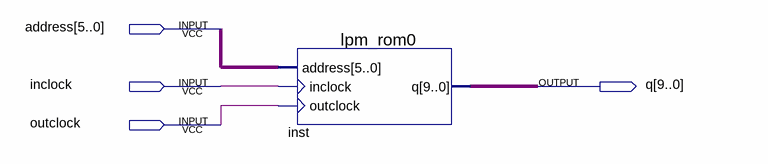
[diagram p0: schematic sheet]
// Quartus schematic lab10_1.bdf as structural Verilog: 1 symbols, 4 pins
module lab10_1 (
  input  [5:0] address,
  input  inclock,
  input  outclock,
  output [9:0] q
);

  lpm_rom0 inst (.address(address), .inclock(inclock), .outclock(outclock), .q(q));
endmodule
